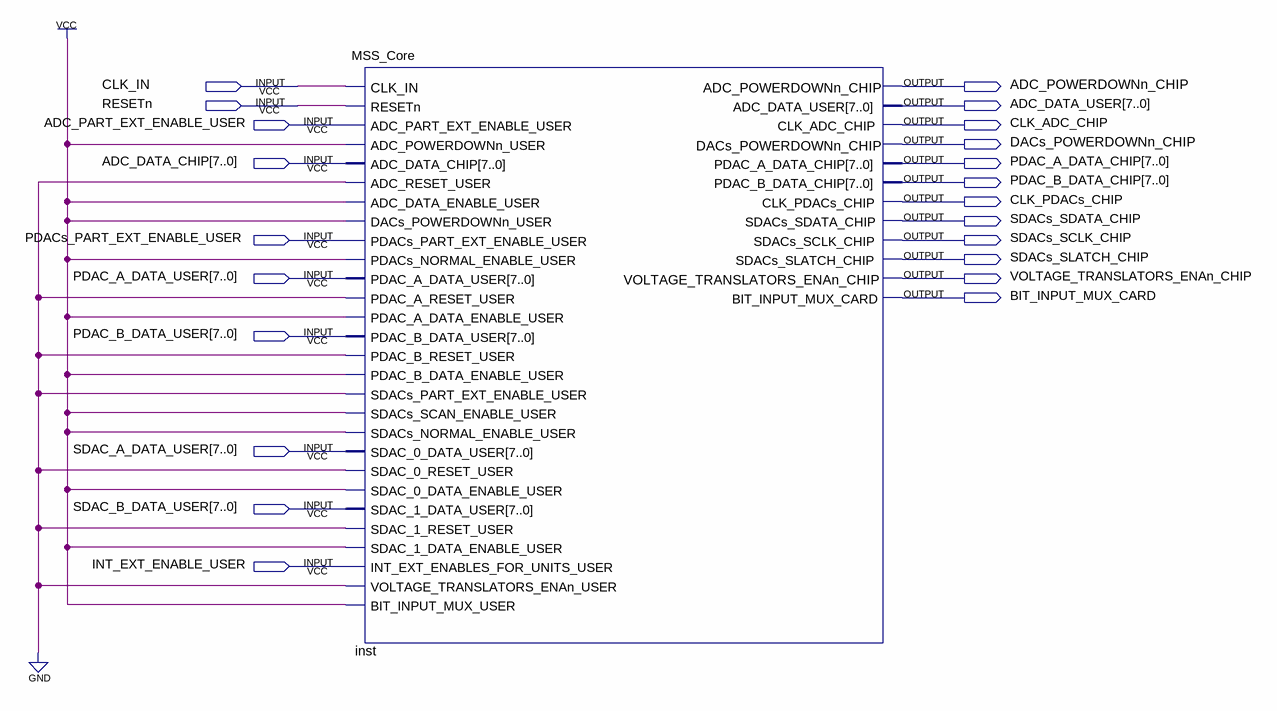
[diagram p0: schematic sheet]
// Quartus schematic MSS_XTRCT.bdf as structural Verilog: 1 symbols, 22 pins
module MSS_XTRCT (
  input  CLK_IN,
  input  RESETn,
  input  ADC_PART_EXT_ENABLE_USER,
  input  [7:0] ADC_DATA_CHIP,
  input  PDACs_PART_EXT_ENABLE_USER,
  input  [7:0] PDAC_A_DATA_USER,
  input  [7:0] PDAC_B_DATA_USER,
  input  [7:0] SDAC_A_DATA_USER,
  input  [7:0] SDAC_B_DATA_USER,
  input  INT_EXT_ENABLE_USER,
  output ADC_POWERDOWNn_CHIP,
  output [7:0] ADC_DATA_USER,
  output CLK_ADC_CHIP,
  output DACs_POWERDOWNn_CHIP,
  output [7:0] PDAC_A_DATA_CHIP,
  output [7:0] PDAC_B_DATA_CHIP,
  output CLK_PDACs_CHIP,
  output SDACs_SDATA_CHIP,
  output SDACs_SCLK_CHIP,
  output SDACs_SLATCH_CHIP,
  output VOLTAGE_TRANSLATORS_ENAn_CHIP,
  output BIT_INPUT_MUX_CARD
);

  MSS_Core inst (
    .CLK_IN(CLK_IN), .RESETn(RESETn), .ADC_PART_EXT_ENABLE_USER(ADC_PART_EXT_ENABLE_USER),
    .ADC_POWERDOWNn_USER(1'b1), .ADC_DATA_CHIP(ADC_DATA_CHIP), .ADC_RESET_USER(1'b0),
    .ADC_DATA_ENABLE_USER(1'b1), .DACs_POWERDOWNn_USER(1'b1),
    .PDACs_PART_EXT_ENABLE_USER(PDACs_PART_EXT_ENABLE_USER), .PDACs_NORMAL_ENABLE_USER(1'b1),
    .PDAC_A_DATA_USER(PDAC_A_DATA_USER), .PDAC_A_RESET_USER(1'b0), .PDAC_A_DATA_ENABLE_USER(1'b1),
    .PDAC_B_DATA_USER(PDAC_B_DATA_USER), .PDAC_B_RESET_USER(1'b0), .PDAC_B_DATA_ENABLE_USER(1'b1),
    .SDACs_PART_EXT_ENABLE_USER(1'b0), .SDACs_SCAN_ENABLE_USER(1'b1), .SDACs_NORMAL_ENABLE_USER(1'b1),
    .SDAC_0_DATA_USER(SDAC_A_DATA_USER), .SDAC_0_RESET_USER(1'b0), .SDAC_0_DATA_ENABLE_USER(1'b1),
    .SDAC_1_DATA_USER(SDAC_B_DATA_USER), .SDAC_1_RESET_USER(1'b0), .SDAC_1_DATA_ENABLE_USER(1'b1),
    .INT_EXT_ENABLES_FOR_UNITS_USER(INT_EXT_ENABLE_USER), .VOLTAGE_TRANSLATORS_ENAn_USER(1'b0),
    .BIT_INPUT_MUX_USER(1'b1), .ADC_POWERDOWNn_CHIP(ADC_POWERDOWNn_CHIP), .ADC_DATA_USER(ADC_DATA_USER),
    .CLK_ADC_CHIP(CLK_ADC_CHIP), .DACs_POWERDOWNn_CHIP(DACs_POWERDOWNn_CHIP),
    .PDAC_A_DATA_CHIP(PDAC_A_DATA_CHIP), .PDAC_B_DATA_CHIP(PDAC_B_DATA_CHIP),
    .CLK_PDACs_CHIP(CLK_PDACs_CHIP), .SDACs_SDATA_CHIP(SDACs_SDATA_CHIP), .SDACs_SCLK_CHIP(SDACs_SCLK_CHIP),
    .SDACs_SLATCH_CHIP(SDACs_SLATCH_CHIP), .VOLTAGE_TRANSLATORS_ENAn_CHIP(VOLTAGE_TRANSLATORS_ENAn_CHIP),
    .BIT_INPUT_MUX_CARD(BIT_INPUT_MUX_CARD));
endmodule
